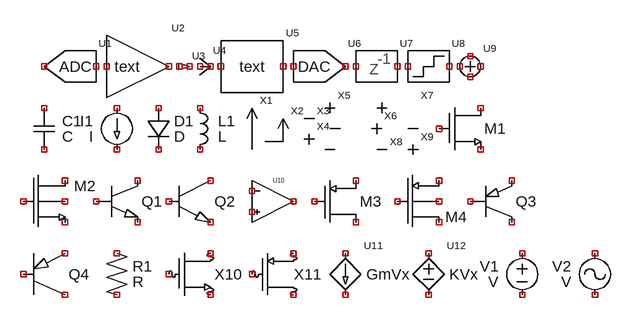
[diagram p0: schematic allSvgSymbols.asc]
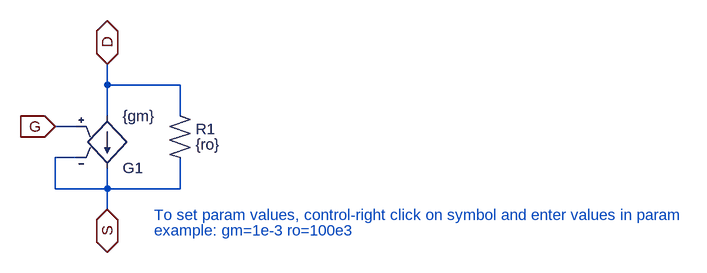
[diagram p1: sub-circuit svg_ss_nmos.asc]
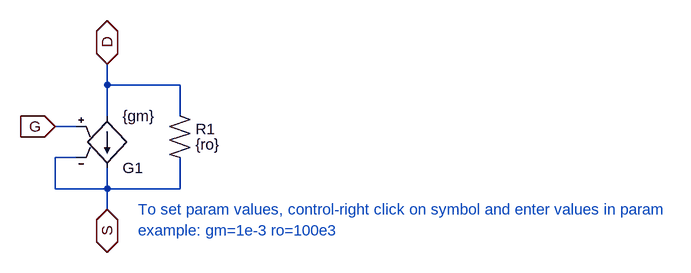
[diagram p2: sub-circuit svg_ss_pmos.asc]
allSvgSymbols.asc, the LTspice schematic file:
Version 4
SHEET 1 1192 680
SYMBOL svg\\svg_block_adc -880 -560 R0
SYMATTR InstName U1
SYMBOL svg\\svg_block_amp -800 -560 R0
SYMATTR InstName U2
SYMBOL svg\\svg_block_arrow -656 -528 R0
SYMATTR InstName U3
SYMBOL svg\\svg_block_arrow2 -624 -528 R0
SYMATTR InstName U4
SYMBOL svg\\svg_block_box -624 -560 R0
SYMATTR InstName U5
SYMBOL svg\\svg_block_dac -496 -560 R0
SYMATTR InstName U6
SYMBOL svg\\svg_block_delay -400 -560 R0
SYMATTR InstName U7
SYMBOL svg\\svg_block_quant -336 -560 R0
SYMATTR InstName U8
SYMBOL svg\\svg_block_sum -224 -544 R0
SYMATTR InstName U9
SYMBOL svg\\svg_cap -896 -464 R0
SYMATTR InstName C1
SYMBOL svg\\svg_current -768 -464 R0
SYMATTR InstName I1
SYMBOL svg\\svg_diode -720 -464 R0
SYMATTR InstName D1
SYMBOL svg\\svg_ind -656 -464 R0
SYMATTR InstName L1
SYMBOL svg\\svg_meas_I -592 -464 R0
SYMATTR InstName X1
SYMBOL svg\\svg_meas_imped -544 -448 R0
SYMATTR InstName X2
SYMBOL svg\\svg_meas_minus -496 -448 R0
SYMATTR InstName X3
SYMBOL svg\\svg_meas_plus -496 -416 R0
SYMATTR InstName X4
SYMBOL svg\\svg_meas_V -464 -464 R0
SYMATTR InstName X5
SYMBOL svg\\svg_meas_V2 -400 -432 R0
SYMATTR InstName X6
SYMBOL svg\\svg_meas_V3 -384 -464 R0
SYMATTR InstName X7
SYMBOL svg\\svg_meas_Vminus -384 -400 R0
SYMATTR InstName X8
SYMBOL svg\\svg_meas_Vplus -336 -400 R0
SYMATTR InstName X9
SYMBOL svg\\svg_nmos -272 -480 R0
SYMATTR InstName M1
SYMBOL svg\\svg_nmos4 -912 -368 R0
SYMATTR InstName M2
SYMBOL svg\\svg_npn -800 -368 R0
SYMATTR InstName Q1
SYMBOL svg\\svg_npn1 -688 -368 R0
SYMATTR InstName Q2
SYMBOL svg\\svg_opamp -528 -384 R0
SYMATTR InstName U10
SYMBOL svg\\svg_pmos -464 -368 R0
SYMATTR InstName M3
SYMBOL svg\\svg_pmos4 -336 -368 R0
SYMATTR InstName M4
SYMBOL svg\\svg_pnp -224 -368 R0
SYMATTR InstName Q3
SYMBOL svg\\svg_pnp1 -912 -256 R0
SYMATTR InstName Q4
SYMBOL svg\\svg_res -784 -240 R0
SYMATTR InstName R1
SYMBOL svg\\svg_ss_nmos -688 -256 R0
SYMATTR InstName X10
SYMBOL svg\\svg_ss_pmos -560 -256 R0
SYMATTR InstName X11
SYMBOL svg\\svg_vccs -416 -240 R0
SYMATTR InstName U11
SYMBOL svg\\svg_vcvs -288 -240 R0
SYMATTR InstName U12
SYMBOL svg\\svg_voltage -144 -240 R0
SYMATTR InstName V1
SYMBOL svg\\svg_voltage2 -32 -240 R0
SYMATTR InstName V2

svg_ss_nmos.asc, the sub-circuit schematic file:
Version 4
SHEET 1 1096 680
WIRE 144 48 144 16
WIRE 256 48 144 48
WIRE 144 96 144 48
WIRE 256 96 256 48
WIRE 96 112 64 112
WIRE 96 160 64 160
WIRE 64 208 64 160
WIRE 144 208 144 176
WIRE 144 208 64 208
WIRE 256 208 256 160
WIRE 256 208 144 208
WIRE 144 240 144 208
FLAG 64 112 G
IOPIN 64 112 In
FLAG 144 240 S
IOPIN 144 240 BiDir
FLAG 144 16 D
IOPIN 144 16 BiDir
SYMBOL g2 144 192 M180
SYMATTR InstName G1
SYMATTR Value {gm}
SYMBOL svg\\svg_res 240 96 R0
SYMATTR InstName R1
SYMATTR Value {ro}
TEXT 216 272 Left 2 ;example: gm=1e-3 ro=100e3
TEXT 216 248 Left 2 ;To set param values, control-right click on symbol and enter values in param

svg_ss_pmos.asc, the sub-circuit schematic file:
Version 4
SHEET 1 1072 680
WIRE 144 48 144 16
WIRE 256 48 144 48
WIRE 144 96 144 48
WIRE 256 96 256 48
WIRE 96 112 64 112
WIRE 96 160 64 160
WIRE 64 208 64 160
WIRE 144 208 144 176
WIRE 144 208 64 208
WIRE 256 208 256 160
WIRE 256 208 144 208
WIRE 144 240 144 208
FLAG 64 112 G
IOPIN 64 112 In
FLAG 144 240 S
IOPIN 144 240 BiDir
FLAG 144 16 D
IOPIN 144 16 BiDir
SYMBOL g2 144 192 M180
SYMATTR InstName G1
SYMATTR Value {gm}
SYMBOL svg\\svg_res 240 96 R0
SYMATTR InstName R1
SYMATTR Value {ro}
TEXT 192 240 Left 2 ;To set param values, control-right click on symbol and enter values in param
TEXT 192 272 Left 2 ;example: gm=1e-3 ro=100e3

The netlist it stands for:
* allSvgSymbols.asc
XU1 NC_01 NC_02 ADC  ; pins 1 2
U2 NC_03 NC_04 text
XU3 NC_05 NC_06 svg_block_arrow  ; pins 1 2
XU4 NC_07 NC_08 svg_block_arrow2  ; pins 1 2
XU5 NC_09 NC_10 text  ; pins 1 2
XU6 NC_11 NC_12 DAC  ; pins 1 2
XU7 NC_13 NC_14 svg_block_delay  ; pins 1 2
XU8 NC_15 NC_16 svg_block_quant  ; pins 1 2
XU9 NC_17 NC_18 NC_19 NC_20 svg_block_sum  ; pins 1 2 3 4
C1 NC_21 NC_22 C
I1 NC_23 NC_24 I
D1 NC_25 NC_26 D
L1 NC_27 NC_28 L
XX1 svg_meas_I
XX2 svg_meas_imped
XX3 svg_meas_minus
XX4 svg_meas_plus
XX5 svg_meas_V
XX6 svg_meas_V2
XX7 svg_meas_V3
XX8 svg_meas_Vminus
XX9 svg_meas_Vplus
M1 NC_29 NC_30 NC_31 NC_31 nmodel W=1E7 L=1E8
M2 NC_32 NC_33 NC_34 NC_35 nmodel W=1E7 L=1E8
Q1 NC_36 NC_37 NC_38 0 NPN
Q2 NC_39 NC_40 NC_41 0 NPN
XU10 NC_42 NC_43 NC_44 opamp Aol=100K GBW=10Meg  ; pins invin noninvin out
M3 NC_45 NC_46 NC_47 NC_47 pmodel W=1E7 L=1E8
M4 NC_48 NC_49 NC_50 NC_51 pmodel W=1E7 L=1E8
Q3 NC_52 NC_53 NC_54 0 PNP
Q4 NC_55 NC_56 NC_57 0 PNP
R1 NC_58 NC_59 R
XX10 NC_60 NC_61 NC_62 svg_ss_nmos
XX11 NC_63 NC_64 NC_65 svg_ss_pmos
XU11 NC_66 NC_67 GmVx  ; pins 1 2
XU12 NC_68 NC_69 KVx  ; pins + -
V1 NC_70 NC_71 V
V2 NC_72 NC_73 V

* block symbol definitions
.subckt svg_ss_nmos D G S
G1 D S G S {gm}
R1 D S {ro}
* example: gm=1e-3 ro=100e3
* To set param values, control-right click on symbol and enter values in param
.ends svg_ss_nmos

.subckt svg_ss_pmos D G S
G1 D S G S {gm}
R1 D S {ro}
* To set param values, control-right click on symbol and enter values in param
* example: gm=1e-3 ro=100e3
.ends svg_ss_pmos

.model D D
.lib standard.dio
.model NPN NPN
.model PNP PNP
.lib standard.bjt
.model NMOS NMOS
.model PMOS PMOS
.lib standard.mos
.backanno
.end